# Altium schematic sheet TopLevel.SchDoc
size A4; SheetNumber: 1; SheetTotal: 15
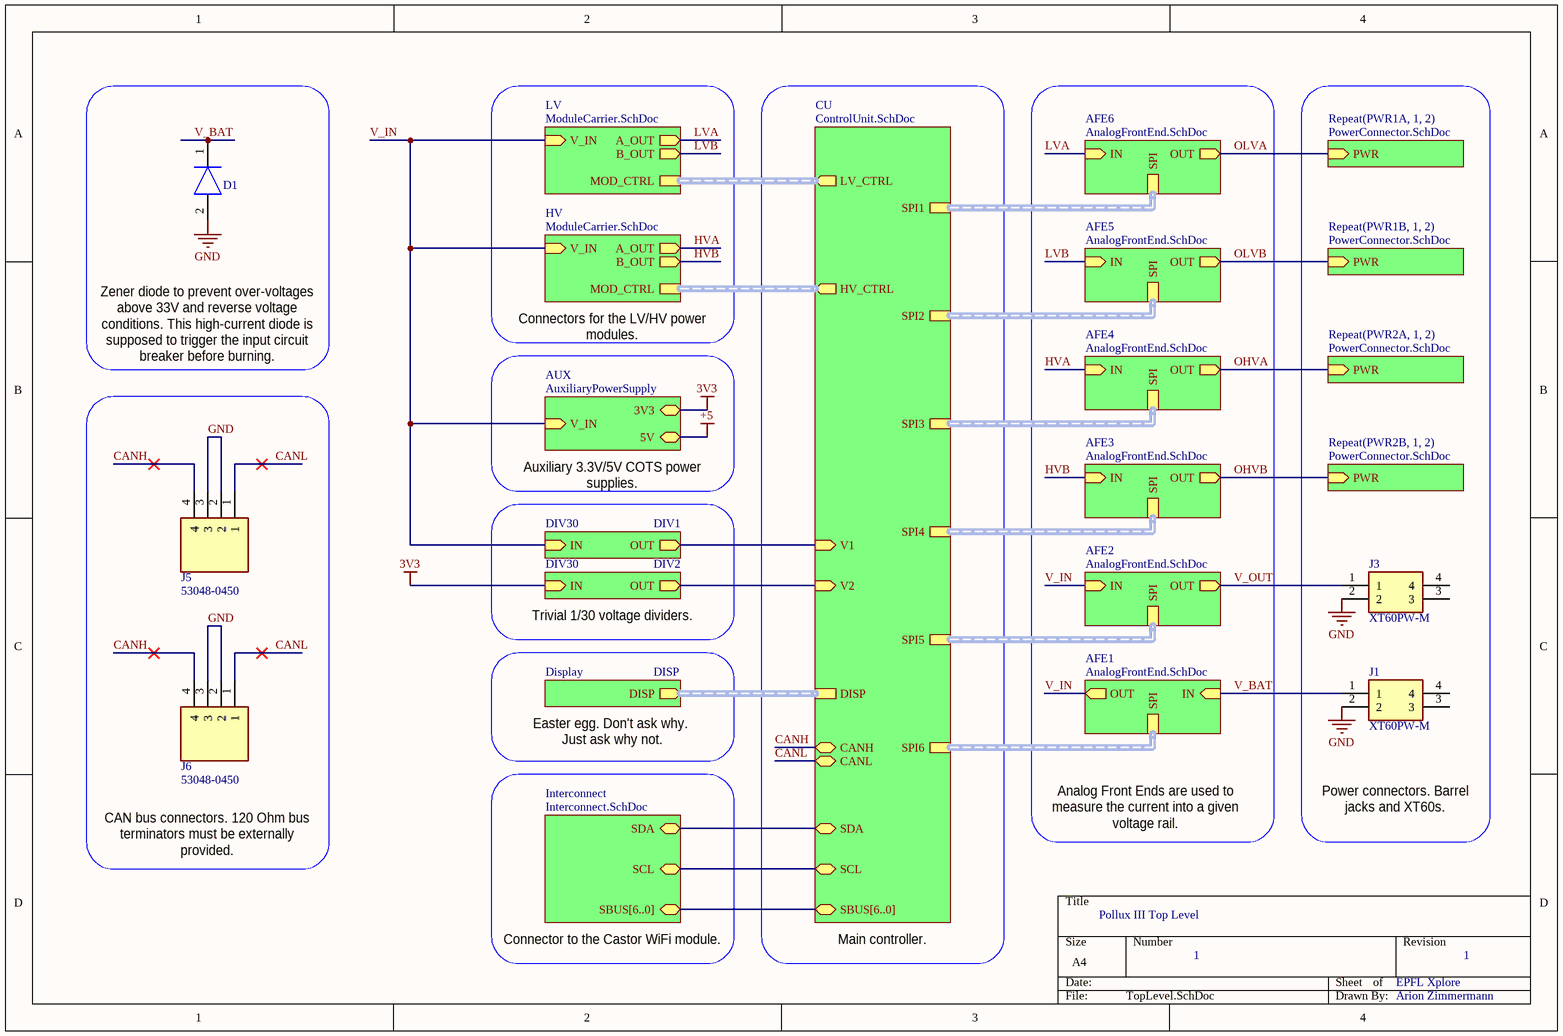
[diagram p0: TopLevel.SchDoc]

## Parts
D1  BZG03C33-HM3-08  [DIOM5127X229N]  (value not drawn)
J1  XT60PW-M  [XT60PWM]
J3  XT60PW-M  [XT60PWM]
J5  53048-0450  [SHDRRA4W35P0X125_1X4_675X550X350P]
J6  53048-0450  [SHDRRA4W35P0X125_1X4_675X550X350P]

## Sub-sheets
AFE1 = AnalogFrontEnd.SchDoc: IN (in), SPI (harness AFE_Harness), OUT (out)
AFE2 = AnalogFrontEnd.SchDoc: IN (in), SPI (harness AFE_Harness), OUT (out)
AFE3 = AnalogFrontEnd.SchDoc: IN (in), SPI (harness AFE_Harness), OUT (out)
AFE4 = AnalogFrontEnd.SchDoc: IN (in), SPI (harness AFE_Harness), OUT (out)
AFE5 = AnalogFrontEnd.SchDoc: IN (in), SPI (harness AFE_Harness), OUT (out)
AFE6 = AnalogFrontEnd.SchDoc: IN (in), SPI (harness AFE_Harness), OUT (out)
AUX = AuxiliaryPowerSupply: V_IN (in), 3V3 (bidir), 5V (bidir)
CU = ControlUnit.SchDoc: LV_CTRL (out, harness MOD_CTRL_Harness), V1 (in), V2 (in), SPI1 (harness AFE_Harness), SPI2 (harness AFE_Harness), SPI3 (harness AFE_Harness), SPI4 (harness AFE_Harness), SPI5 (harness AFE_Harness), SPI6 (harness AFE_Harness), SDA (bidir), SCL (bidir), SBUS[6..0] (bidir), CANH (bidir), CANL (bidir), HV_CTRL (out, harness MOD_CTRL_Harness), DISP (harness DISP_Harness)
DISP = Display: DISP (out, harness DISP_Harness)
DIV1 = DIV30: OUT (out), IN (in)
DIV2 = DIV30: OUT (out), IN (in)
HV = ModuleCarrier.SchDoc: A_OUT (out), V_IN (in), B_OUT (out), MOD_CTRL (harness MOD_CTRL_Harness)
Interconnect = Interconnect.SchDoc: SBUS[6..0] (bidir), SCL (bidir), SDA (bidir)
LV = ModuleCarrier.SchDoc: A_OUT (out), V_IN (in), B_OUT (out), MOD_CTRL (harness MOD_CTRL_Harness)
Repeat(PWR1A, 1, 2) = PowerConnector.SchDoc: PWR (in)
Repeat(PWR1B, 1, 2) = PowerConnector.SchDoc: PWR (in)
Repeat(PWR2A, 1, 2) = PowerConnector.SchDoc: PWR (in)
Repeat(PWR2B, 1, 2) = PowerConnector.SchDoc: PWR (in)

## Nets
3V3: sheet DIV2/IN, sheet AUX/3V3
+5: sheet AUX/5V
GND: D1.2(A) J1.2 J3.2 J5.2 J5.3 J6.2 J6.3
CANH: J5.4 J6.4 ; sheet CU/CANH
CANL: J5.1 J6.1 ; sheet CU/CANL
HVA: sheet HV/A_OUT, sheet AFE4/IN
HVB: sheet HV/B_OUT, sheet AFE3/IN
LVA: sheet LV/A_OUT, sheet AFE6/IN
LVB: sheet LV/B_OUT, sheet AFE5/IN
OHVA: sheet Repeat(PWR2A, 1, 2)/PWR, sheet AFE4/OUT
OHVB: sheet Repeat(PWR2B, 1, 2)/PWR, sheet AFE3/OUT
OLVA: sheet AFE6/OUT, sheet Repeat(PWR1A, 1, 2)/PWR
OLVB: sheet Repeat(PWR1B, 1, 2)/PWR, sheet AFE5/OUT
V_BAT: D1.1(K) J1.1 ; sheet AFE1/IN
V_IN: sheet LV/V_IN, sheet HV/V_IN, sheet DIV1/IN, sheet AUX/V_IN, sheet AFE2/IN, sheet AFE1/OUT
V_OUT: J3.1 ; sheet AFE2/OUT
(unnamed): sheet CU/V1, sheet DIV1/OUT
(unnamed): sheet CU/V2, sheet DIV2/OUT
(unnamed): sheet CU/SDA, sheet Interconnect/SDA
(unnamed): sheet CU/SCL, sheet Interconnect/SCL

Not connected (* = marked no-connect by the designer): J1 3 4; J3 3 4

## Buses and harness runs
bus sheet CU/SBUS[6..0] = sheet Interconnect/SBUS[6..0]
harness sheet AFE1/SPI = sheet CU/SPI6
harness sheet AFE2/SPI = sheet CU/SPI5
harness sheet AFE3/SPI = sheet CU/SPI4
harness sheet AFE4/SPI = sheet CU/SPI3
harness sheet AFE5/SPI = sheet CU/SPI2
harness sheet AFE6/SPI = sheet CU/SPI1
harness sheet CU/DISP = sheet DISP/DISP
harness sheet CU/HV_CTRL = sheet HV/MOD_CTRL
harness sheet CU/LV_CTRL = sheet LV/MOD_CTRL

## Notes on the sheet
- Zener diode to prevent over-voltages above 33V and reverse voltage conditions. This high-current diode is supposed to trigger the input circuit breaker before burning.
- Connectors for the LV/HV power modules.
- Auxiliary 3.3V/5V COTS power supplies.
- Trivial 1/30 voltage dividers.
- Easter egg. Don't ask why.
  Just ask why not.
- Analog Front Ends are used to measure the current into a given voltage rail.
- Power connectors. Barrel jacks and XT60s.
- CAN bus connectors. 120 Ohm bus terminators must be externally provided.
- Pollux III Top Level
- Connector to the Castor WiFi module.
- Main controller.
- 1
- EPFL Xplore
- Arion Zimmermann

## Library data of the parts
D1 = BZG03C33-HM3-08: Diode; Manufacturer_Name: Vishay; Datasheet Link: https://www.arrow.com/en/products/bzg03c33-hm3-08/vishay; Height: 2.29mm; Manufacturer_Part_Number: BZG03C33-HM3-08; Mouser Part Number: 78-BZG03C33-HM3-08; Mouser Price/Stock: https://www.mouser.co.uk/ProductDetail/Vishay-Semiconductors/BZG03C33-HM3-08?qs=j%252B1pi9TdxUbhV%2FXINkfeTw%3D%3D; Arrow Part Number: BZG03C33-HM3-08; Arrow Price/Stock: https://www.arrow.com/en/products/bzg03c33-hm3-08/vishay
J1 J3 = XT60PW-M: Connector; Manufacturer_Name: Changzou Amass Elec; Datasheet Link: https://www.tme.eu/Document/9b8d0c5eb7094295f3d3112c214d3ade/XT60PW%20SPEC.pdf; Height: 8.4mm; Manufacturer_Part_Number: XT60PW-M
J5 J6 = 53048-0450: Connector; Manufacturer_Name: Molex; Datasheet Link: https://www.molex.com/pdm_docs/sd/530480450_sd.pdf; Height: 3.5mm; Manufacturer_Part_Number: 53048-0450; Mouser Part Number: 538-53048-0450; Mouser Price/Stock: https://www.mouser.co.uk/ProductDetail/Molex/53048-0450?qs=0lSvoLzn4L%252Bhzo05ywM78Q%3D%3D